# EAGLE design currentSensingBoard (EAGLE 9.6.2)
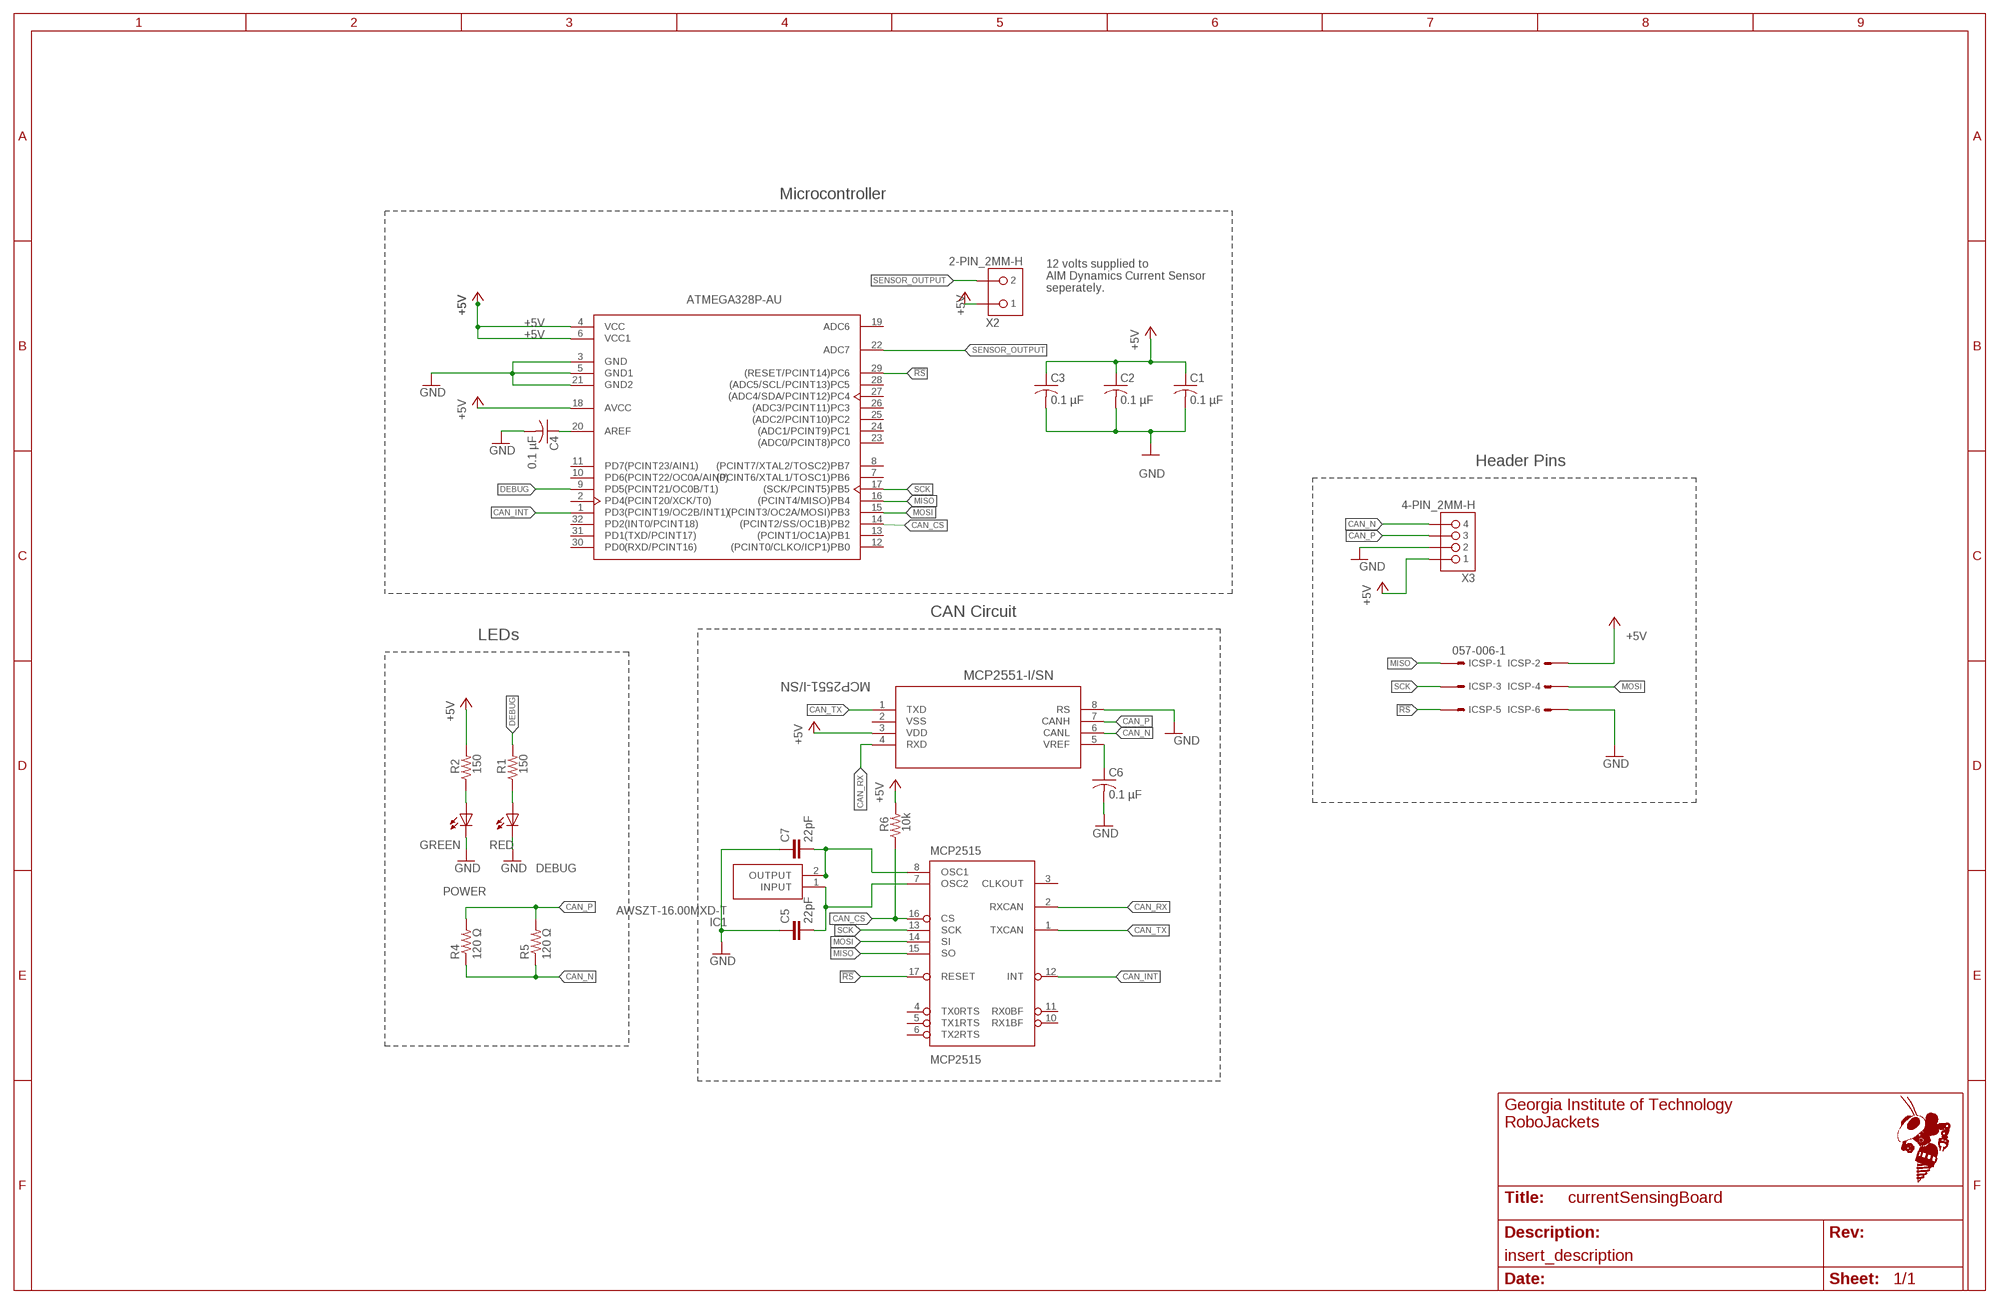
[diagram p0: schematic, sheet 1]
FRAME1 (FRAME_B_L): SCH_DESC: insert_description

## Parts
ATMEGA328P-AU(V1)  ATMEGA328P-AU (V1)  ATMEGA328P-AU  [TQFP-32]
C1  0.1 µF  C-USC0603  [C0603]
C2  0.1 µF  C-USC0603  [C0603]
C3  0.1 µF  C-USC0603  [C0603]
C4  0.1 µF  C-USC0603  [C0603]
C5  22pF  22PF-50V-5%(0603)  [0603-CAP]
C6  0.1 µF  C-USC0603  [C0603]
C7  22pF  22PF-50V-5%(0603)  [0603-CAP]
DEBUG  RED  LED-SMD-RED  [CHIP-LED0603]
IC1  AWSZT-16.00MXD-T  [AWSZT1600MXDT]
ICSP  057-006-1  [057-006-1]
MCP2515  MCP2515  MCP2510SO  [SO-18W]
MCP2551-I/SN  MCP2551-I/SN  [SOIC8-N_MC]
POWER  GREEN  LED-SMD-GREEN  [CHIP-LED0603]
R1  150  R-US_R0603  [R0603]
R2  150  R-US_R0603  [R0603]
R4  120 Ω  R-US_R0603  [R0603]
R5  120 Ω  R-US_R0603  [R0603]
R6  10k  R-US_R0603  [R0603]
X2  2-PIN_2MM-H  [2MM-2-H]
X3  4-PIN_2MM-H  [2MM-4-H]

## Nets
!RS: ATMEGA328P-AU(V1).29((RESET/PCINT14)PC6) ICSP.5 MCP2515.17(RESET)
+5V: ATMEGA328P-AU(V1).4(VCC) ATMEGA328P-AU(V1).6(VCC1) ATMEGA328P-AU(V1).18(AVCC) C1.1 C2.1 C3.1 ICSP.2 MCP2551-I/SN.3(VDD) R2.2 R6.2 X2.1 X3.1
CAN_CS: ATMEGA328P-AU(V1).14((PCINT2/SS/OC1B)PB2) MCP2515.16(CS) R6.1
CAN_INT: ATMEGA328P-AU(V1).1(PD3(PCINT19/OC2B/INT1)) MCP2515.12(INT)
CAN_N: MCP2551-I/SN.6(CANL) R4.1 R5.1 X3.4
CAN_P: MCP2551-I/SN.7(CANH) R4.2 R5.2 X3.3
CAN_RX: MCP2515.2(RXCAN) MCP2551-I/SN.4(RXD)
CAN_TX: MCP2515.1(TXCAN) MCP2551-I/SN.1(TXD)
CLK1: C5.2 IC1.1(INPUT) MCP2515.7(OSC2)
CLK2: C7.2 IC1.2(OUTPUT) MCP2515.8(OSC1)
DEBUG: ATMEGA328P-AU(V1).9(PD5(PCINT21/OC0B/T1)) R1.2
GND: ATMEGA328P-AU(V1).3(GND) ATMEGA328P-AU(V1).5(GND1) ATMEGA328P-AU(V1).21(GND2) C1.2 C2.2 C3.2 C4.2 C5.1 C6.2 C7.1 DEBUG.C(K) ICSP.6 MCP2551-I/SN.8(RS) POWER.C(K) X3.2
MISO: ATMEGA328P-AU(V1).16((PCINT4/MISO)PB4) ICSP.1 MCP2515.15(SO)
MOSI: ATMEGA328P-AU(V1).15((PCINT3/OC2A/MOSI)PB3) ICSP.4 MCP2515.14(SI)
N$1: DEBUG.A R1.1
N$4: C6.1 MCP2551-I/SN.5(VREF)
N$6: ATMEGA328P-AU(V1).20(AREF) C4.1
N$7: POWER.A R2.1
SCK: ATMEGA328P-AU(V1).17((SCK/PCINT5)PB5) ICSP.3 MCP2515.13(SCK)
SENSOR_OUTPUT: ATMEGA328P-AU(V1).22(ADC7) X2.2
Unconnected: ATMEGA328P-AU(V1).2(PD4(PCINT20/XCK/T0)) ATMEGA328P-AU(V1).7((PCINT6/XTAL1/TOSC1)PB6) ATMEGA328P-AU(V1).8((PCINT7/XTAL2/TOSC2)PB7) ATMEGA328P-AU(V1).10(PD6(PCINT22/OC0A/AIN0)) ATMEGA328P-AU(V1).11(PD7(PCINT23/AIN1)) ATMEGA328P-AU(V1).12((PCINT0/CLKO/ICP1)PB0) ATMEGA328P-AU(V1).13((PCINT1/OC1A)PB1) ATMEGA328P-AU(V1).19(ADC6) ATMEGA328P-AU(V1).23((ADC0/PCINT8)PC0) ATMEGA328P-AU(V1).24((ADC1/PCINT9)PC1) ATMEGA328P-AU(V1).25((ADC2/PCINT10)PC2) ATMEGA328P-AU(V1).26((ADC3/PCINT11)PC3) ATMEGA328P-AU(V1).27((ADC4/SDA/PCINT12)PC4) ATMEGA328P-AU(V1).28((ADC5/SCL/PCINT13)PC5) ATMEGA328P-AU(V1).30(PD0(RXD/PCINT16)) ATMEGA328P-AU(V1).31(PD1(TXD/PCINT17)) ATMEGA328P-AU(V1).32(PD2(INT0/PCINT18)) MCP2515.3(CLKOUT) MCP2515.4(TX0RTS) MCP2515.5(TX1RTS) MCP2515.6(TX2RTS) MCP2515.10(RX1BF) MCP2515.11(RX0BF) MCP2551-I/SN.2(VSS)

## Notes on the sheet
- Microcontroller
- 12 volts supplied to
  AIM Dynamics Current Sensor
  seperately.
- Header Pins
- CAN Circuit
- LEDs

## Power pins joined to a net without a drawn wire
VDD: MCP2515.18(VDD)
VSS: MCP2515.9(VSS)

## Library data of the parts
ATMEGA328P-AU(V1) = Microcontroller:ATMEGA328P-AU: IC MCU 8BIT 32KB FLASH 32TQFP Manufacturer's datasheet <http://ww1.microchip.com/downloads/en/DeviceDoc/ATmega48A-PA-88A-PA-168A-PA-328-P-DS-DS40002061A.pdf>; CREATED_BY: PCBLayout.com; DIGIKEY_PART_NUMBER: ATMEGA328P-AU-ND; MANUFACTURER: Microchip Technology; MPN: ATMEGA328P-AU; PACKAGE: TQFP-32; PARTS_NAME: ATMEGA328P-AU
C1-C4 C6 = rcl:C-US: CAPACITOR, American symbol; SPICEPREFIX: C
C5 C7 = SparkFun-Capacitors:22PF-50V-5%(0603): CAP-07876; PROD_ID: CAP-07876
DEBUG = RoboJackets-LEDs:LED-SMD; DIGIKEY: 160-1447-1-ND; MPN: LTST-C191KRKT
IC1 = AWSZT-16.00MXD-T:AWSZT-16.00MXD-T: Resonators CER RES 16.0000MHZ SMD Source: Datasheet; DESCRIPTION: Resonators CER RES 16.0000MHZ SMD; HEIGHT: 1.4mm; MANUFACTURER_NAME: ABRACON; MANUFACTURER_PART_NUMBER: AWSZT-16.00MXD-T; MOUSER_PART_NUMBER: 815-AWSZT-16.00MXDT; MOUSER_PRICE-STOCK: https://www.mouser.co.uk/ProductDetail/ABRACON/AWSZT-1600MXD-T?qs=m%252BUhWDcpCfaa%252BEjQqJFXqQ%3D%3D
ICSP = con-panduit:057-006-: CONNECTOR 6-pin series 057 contact pc board low profile headers; OC_FARNELL: unknown; OC_NEWARK: unknown
MCP2515 = SparkFun-DigitalIC:MCP2510: CAN controller with SPI interface to any MCU. Original design by Microchip.; PROD_ID: IC-09906
MCP2551-I/SN = RoboJackets-ICs:MCP2551-I/SN; MANUFACTURER_PART_NUMBER: MCP2551ISN; VENDOR: Microchip
POWER = RoboJackets-LEDs:LED-SMD; DIGIKEY: 160-1446-1-ND; MPN: LTST-C191KGKT
R1 R2 R4-R6 = rcl:R-US_: RESISTOR, American symbol; SPICEPREFIX: R
X2 = RoboJackets-Connectors:2-PIN_2MM-*; PINS: 2; PIN_PITCH: 2.0 mm
X3 = RoboJackets-Connectors:4-PIN_2MM-*: MPN: 0353630460; DIGIKEY: WM18933-ND; MPN: 0353630460

## Board
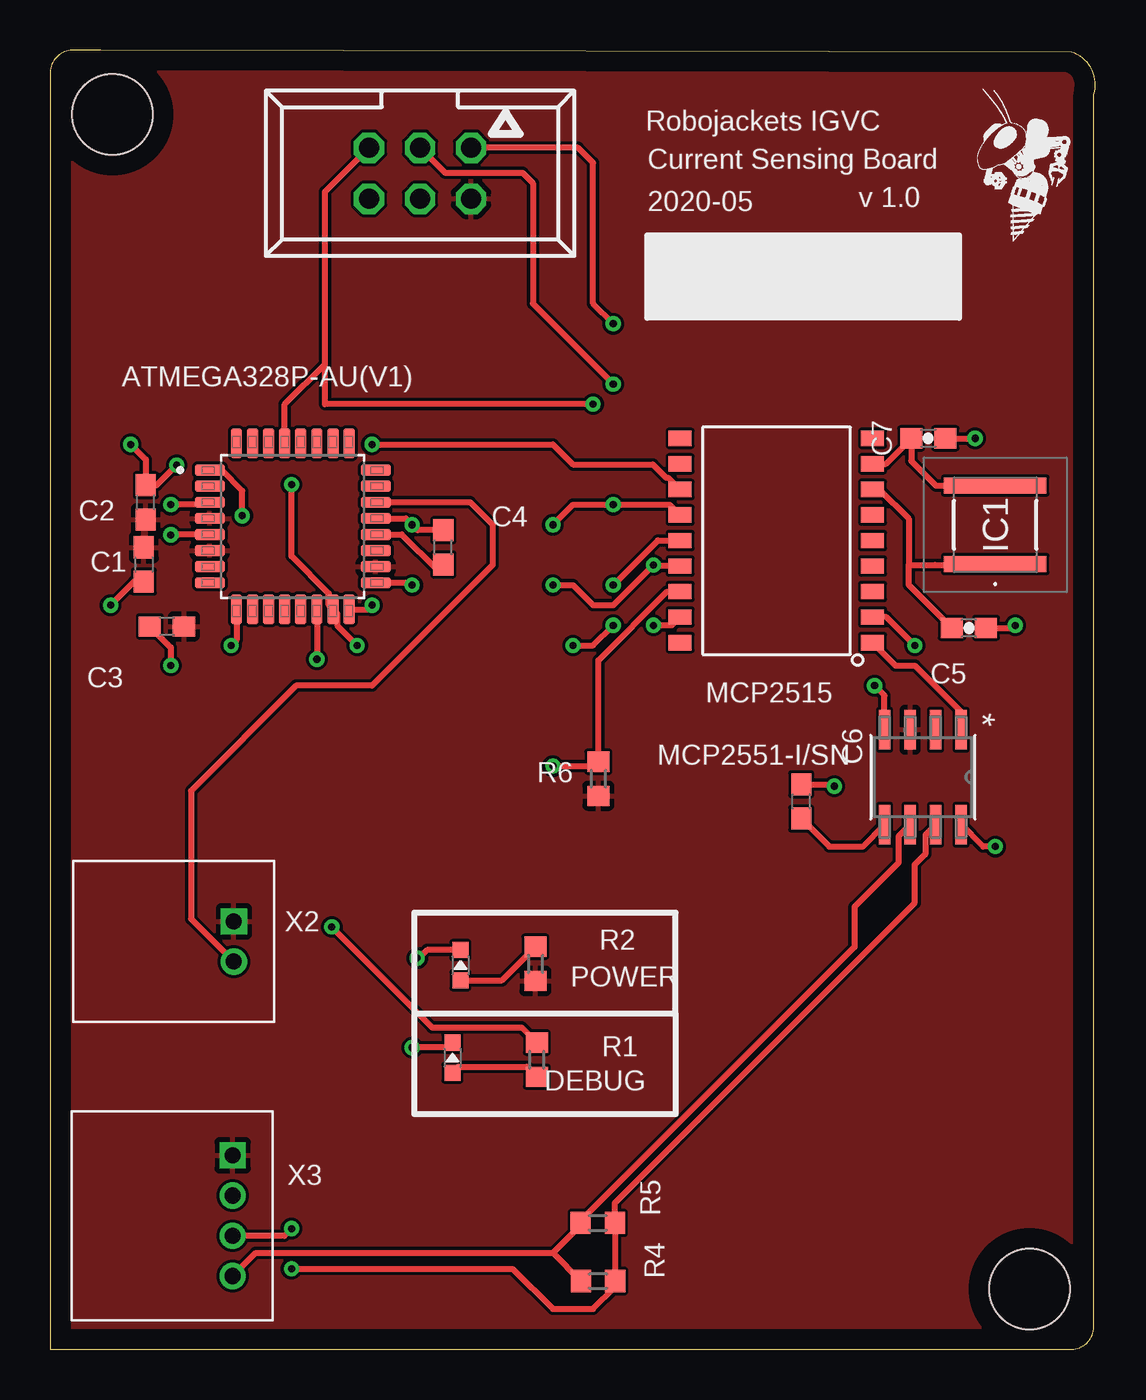
[diagram p1: board, top side]
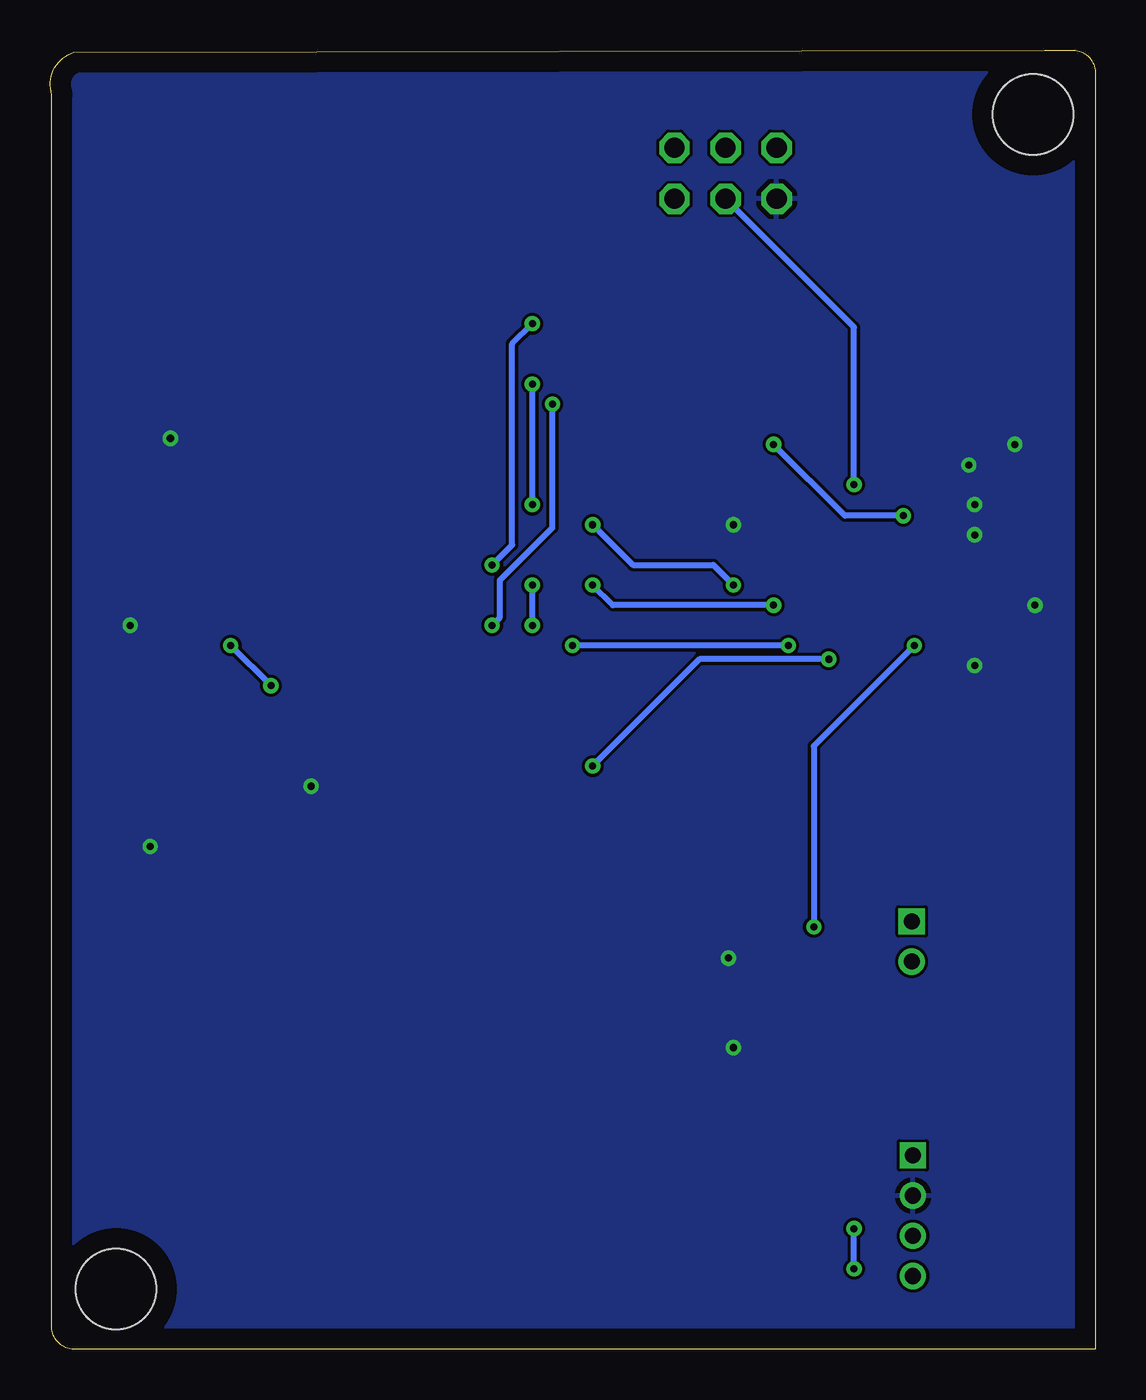
[diagram p2: board, bottom side, seen from below]

Size 51.98 x 64.6 mm. Coordinates in mm from the lower left corner, seen from the top.
Outline: 0,0 50.8,0 arc90 51.9,1.1 51.9,62.4 arc90 50.8,64.5 2.5,64.6 1.1,64.6 arc90 0,63.5 0,0
Copper layers (1*16): Top 0.035mm / dielectric 1.5mm / Bottom 0.035mm
Design rules "default": minimum track width 6mil, minimum drill 0.35mm, track to track 6mil, track to pad 6mil, pad to pad 6mil, via to via 6mil, smd to smd 6mil, copper to edge 40mil, drill to drill 6mil, minimum pad ring 10mil, minimum via ring 8mil, stop-mask expansion 4mil, vias tented up to drill 0mil, thermal gap 10mil
Holes 4 mm at 3.1,61.4 48.7,3

### Footprints (pad centres in the part's own frame; a part is rotated, then mirrored left to right if it is on the bottom)
TQFP-32 = smd 1.5 x 0.57: 1 -4.13,2.8; 2 -4.13,2; 3 -4.13,1.2; 4 -4.13,0.4; 5 -4.13,-0.4; 6 -4.13,-1.2; 7 -4.13,-2; 8 -4.13,-2.8; 17 4.13,-2.8; 18 4.13,-2; 19 4.13,-1.2; 20 4.13,-0.4; 21 4.13,0.4; 22 4.13,1.2; 23 4.13,2; 24 4.13,2.8 | smd 0.57 x 1.5: 9 -2.8,-4.13; 10 -2,-4.13; 11 -1.2,-4.13; 12 -0.4,-4.13; 13 0.4,-4.13; 14 1.2,-4.13; 15 2,-4.13; 16 2.8,-4.13; 25 2.8,4.13; 26 2,4.13; 27 1.2,4.13; 28 0.4,4.13; 29 -0.4,4.13; 30 -1.2,4.13; 31 -2,4.13; 32 -2.8,4.13
C0603 = smd 1.1 x 1: 1 -0.85,0; 2 0.85,0
0603-CAP = smd 1.1 x 1: 1 -0.85,0; 2 0.85,0
CHIP-LED0603 = smd 0.8 x 0.8: A 0,-0.75; C 0,0.75
AWSZT1600MXDT = smd 0.8 x 5.1: 1 -1.95,0; 2 1.95,0
057-006-1 = drill 1 octagon: 1 -2.54,-1.27; 2 -2.54,1.27; 3 0,-1.27; 4 0,1.27; 5 2.54,-1.27; 6 2.54,1.27
SO-18W = smd 0.762 x 1.143: 1 -5.08,-4.788; 2 -3.81,-4.788; 3 -2.54,-4.788; 4 -1.27,-4.788; 5 0,-4.788; 6 1.27,-4.788; 7 2.54,-4.788; 8 3.81,-4.788; 9 5.08,-4.788; 10 5.08,4.788; 11 3.81,4.788; 12 2.54,4.788; 13 1.27,4.788; 14 0,4.788; 15 -1.27,4.788; 16 -2.54,4.788; 17 -3.81,4.788; 18 -5.08,4.788
SOIC8-N_MC = smd 1.981 x 0.559: 1 -2.362,1.905; 2 -2.362,0.635; 3 -2.362,-0.635; 4 -2.362,-1.905; 5 2.362,-1.905; 6 2.362,-0.635; 7 2.362,0.635; 8 2.362,1.905
R0603 = smd 1 x 1.1: 1 -0.85,0; 2 0.85,0
2MM-2-H = drill 0.8 square: 1 0,0 | drill 0.8: 2 2,0
2MM-4-H = drill 0.8 square: 1 -3,0 | drill 0.8: 2 -1,0; 3 1,0; 4 3,0

### Placement (x,y rotation side)
ATMEGA328P-AU(V1)  12.06,40.92 0 top
C1  4.65,39.03 270 top
C2  4.75,42.12 90 top
C3  5.8,35.95 180 top
C4  19.55,39.88 90 top
C5  45.69,35.87 180 top
C6  37.35,27.24 90 top
C7  43.67,45.3 180 top
DEBUG  20,14.5 0 top
IC1  47,41 90 top
ICSP  18.39,58.48 180 top
MCP2515  36.11,40.22 90 top
MCP2551-I/SN  43.4,28.45 270 top
POWER  20.4,19.1 0 top
R1  24.2,14.4 90 top
R2  24.13,19.17 270 top
R4  27.25,3.39 0 top
R5  27.23,6.28 0 top
R6  27.26,28.37 270 top
U$1  [ROBOBUZZ_0.4X]  47.88,55.11 0 top
X2  9.13,21.28 270 top
X3  9.07,6.64 270 top

### Tracks (layer width: path | path; a pad name or v marks a point on that pad's centre or on a via)
!RS  (via drill 0.35)
  Top 0.305: MCP2515.17 30.91,36 v30,36 | ATMEGA328P-AU(V1).29 11.66,47 13.66,49 | 13.66,49 13.66,47 v27,47 | 13.66,49 13.66,57.56 ICSP.5
  Bottom 0.305: v30,36 29.61,36.39 29.61,38.25 27,40.86 v27,47
+5V
  pour Top: 0,64.78 0,0 52,0 52,64.48
CAN_CS  (via drill 0.35)
  Top 0.152: 30.68,37.68 MCP2515.16
  Top 0.305: 30.68,37.68 27.26,34.26 R6.1 27.04,29 v25,29 | ATMEGA328P-AU(V1).14 v13.26,34.31
  Bottom 0.305: v13.26,34.31 19.69,34.31 v25,29
CAN_INT  (via drill 0.35)
  Top 0.305: v16,45 25,45 26,44 29.97,44 30.62,43.34 30.74,43.34 MCP2515.12 | v9.55,41.45 9.55,42.68 8.51,43.72 ATMEGA328P-AU(V1).1
  Bottom 0.305: v9.55,41.45 12.45,41.45 v16,45
CAN_N
  Top 0.305: MCP2551-I/SN.6 42.2,25.52 42.2,24.8 42.2,24.2 40,22 40,20 26.38,6.38 R5.1 26.38,6.17 25,4.79 | X3.4 10.21,4.79 25,4.79 | 25,4.79 R4.1
CAN_P  (via drill 0.35)
  Top 0.152: 43.5,24.6 43.53,24.64
  Top 0.305: 43.53,24.64 43.53,25.59 MCP2551-I/SN.7 | v12,6 11.64,5.64 X3.3 | 28.08,3.41 R5.2 28.08,7.28 43,22.2 43,24.1 43.5,24.6 | 28.08,3.41 R4.2 | v12,4 23,4 25,2 27,2 28.08,3.08 28.08,3.41
  Bottom 0.305: v12,4 v12,6
CAN_RX  (via drill 0.35)
  Top 0.305: MCP2551-I/SN.4 41.49,32.51 v41,33 | MCP2515.2 41.59,36.41 v43,35
  Bottom 0.305: v41,33 v43,35
CAN_TX
  Top 0.305: MCP2515.1 42.04,34 43,34 45.3,31.7 MCP2551-I/SN.1
CLK1
  Top 0.152: 46.95,39 IC1.1
  Top 0.305: C5.2 42.7,38.01 42.7,39 | 42.7,39 42.7,41.3 41.24,42.76 MCP2515.7 | 42.7,39 44,39 46.95,39
CLK2
  Top 0.152: 44,43 44.05,42.95
  Top 0.305: 44,43 42.82,44.18 C7.2 41.55,44.03 MCP2515.8 | 44.05,42.95 IC1.2
DEBUG  (via drill 0.35)
  Top 0.305: R1.2 23.45,16 19,16 v14,21 | ATMEGA328P-AU(V1).9 9.26,35.26 v9,35
  Bottom 0.305: v14,21 14,30 v9,35
GND  (via drill 0.35)
  Top 0.152: ATMEGA328P-AU(V1).5 7.45,40.52
  Top 0.305: v6.29,43.97 5.29,42.97 C2.2 4.75,44.25 v4,45 | v47,25 46.39,25 MCP2551-I/SN.8 | ATMEGA328P-AU(V1).3 7.81,42 v6,42 | 7.45,40.52 6.02,40.52 v6,40.5 | C1.2 4.18,38.18 v3,37 | C3.2 6,34.9 v6,34 | POWER.C 18.75,19.85 18.3,19.4 v18.25,19.45 | ATMEGA328P-AU(V1).21 17.68,41.32 v18,41 18.27,40.73 C4.2 | C6.2 38.91,28.09 v39,28 | C5.1 48,35.87 v48,36 | DEBUG.C 19.75,15 v18,15 | C7.1 v46,45.3
  pour Bottom: -0.19,64.6 0.01,0 52,0 52,64.6
MISO  (via drill 0.35)
  Top 0.152: 30.05,38.95 v30,39
  Top 0.305: MCP2515.15 30.05,38.95 | v28,51 27,52 27,59 26.25,59.75 ICSP.1 | v30,39 28,37 27,37 26,38 v25,38 | ATMEGA328P-AU(V1).16 15.79,36.79 v16,37
  Bottom 0.305: v30,39 29,40 29,50 v28,51 | v16,37 24,37 v25,38
MOSI  (via drill 0.35)
  Top 0.305: v28,38 30.22,40.22 MCP2515.14 | v28,36 27,35 v26,35 | v15.27,35 14.27,36 14.27,36.58 ATMEGA328P-AU(V1).15 13.85,37 13.85,37.58 12,39.43 v12,43
  Bottom 0.305: v28,36 v28,38 | v15.27,35 v26,35 | v12,43 12,50.82 ICSP.4
N$1
  Top 0.152: DEBUG.A 20.3,14.05
  Top 0.305: 20.3,14.05 23.7,14.05 R1.1
N$4
  Top 0.305: MCP2551-I/SN.5 40.41,25 38.74,25 C6.1
N$6
  Top 0.152: 19.26,38.74 C4.1
  Top 0.305: ATMEGA328P-AU(V1).20 17.48,40.52 19.26,38.74
N$7
  Top 0.305: POWER.A 22.46,18.35 R2.1
SCK  (via drill 0.35)
  Top 0.305: MCP2515.13 30.81,42 v28,42 26,42 v25,41 | ICSP.3 19.64,58.5 23.5,58.5 24,58 24,52 v28,48 | ATMEGA328P-AU(V1).17 17.88,38.12 v18,38
  Bottom 0.305: v28,42 v28,48 | v18,38 19,39 23,39 v25,41
SENSOR_OUTPUT
  Top 0.305: ATMEGA328P-AU(V1).22 20.88,42.12 22,41 22,39 16,33 12.22,33 7,27.77 7,21.41 X2.2

### Text on the board
tPlace: Robojackets IGVC | Current Sensing Board | 2020-05 | v 1.0
tDocu: !RS | SCK | MISO | 4mm | Sensor Output | Sensor Output | CAN_P | CAN_N